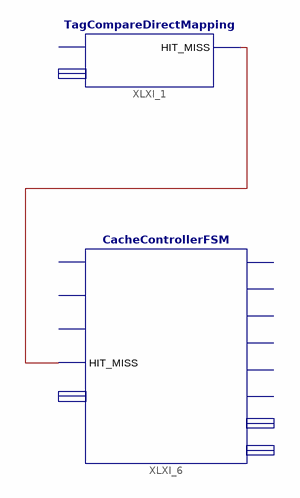
[diagram p0: schematic sheet 1]
// Xilinx ISE schematic CacheControllerSchematic.sch (spartan3e) as structural Verilog: 2 symbols, 0 ports
module CacheControllerSchematic (
);

  wire XLXN_26;

  TagCompareDirectMapping XLXI_1 (.HIT_MISS(XLXN_26));  // open: clk, CPU_ADD
  CacheControllerFSM XLXI_6 (.HIT_MISS(XLXN_26));  // open: clk, WR_RD, CS, CPU_ADD, WEN_CACHE, CACHE_DIN_EN, CACHE_DOUT_EN, WEN_SDRAM, MSTRB, RDY, SDRAM_ADD, CACHE_ADD
endmodule
